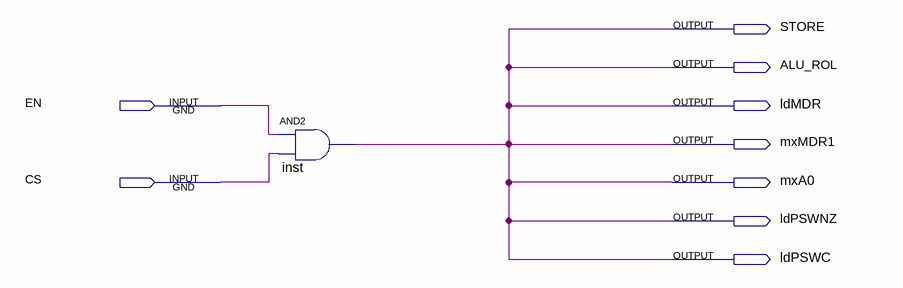
[diagram p0: schematic sheet]
// Quartus schematic ROL.bdf as structural Verilog: 1 symbols, 9 pins
module ROL (
  input  EN,
  input  CS,
  output STORE,
  output ALU_ROL,
  output ldMDR,
  output mxMDR1,
  output mxA0,
  output ldPSWNZ,
  output ldPSWC
);

  and inst (ALU_ROL, EN, CS);

  assign ldMDR = ALU_ROL;
  assign ldPSWC = ALU_ROL;
  assign ldPSWNZ = ALU_ROL;
  assign mxA0 = ALU_ROL;
  assign mxMDR1 = ALU_ROL;
  assign STORE = ALU_ROL;
endmodule
